# Altium schematic sheet SensePlates.SchDoc: Sense&Connectors
size Tabloid; Organization: Altium Limited; Address1: L3, 12a Rodborough Rd; Address2: Frenchs Forest; Address3: NSW; Address4: Australia 2086; DocumentNumber: LM-002; Revision: F; SheetNumber: 3; SheetTotal: 4
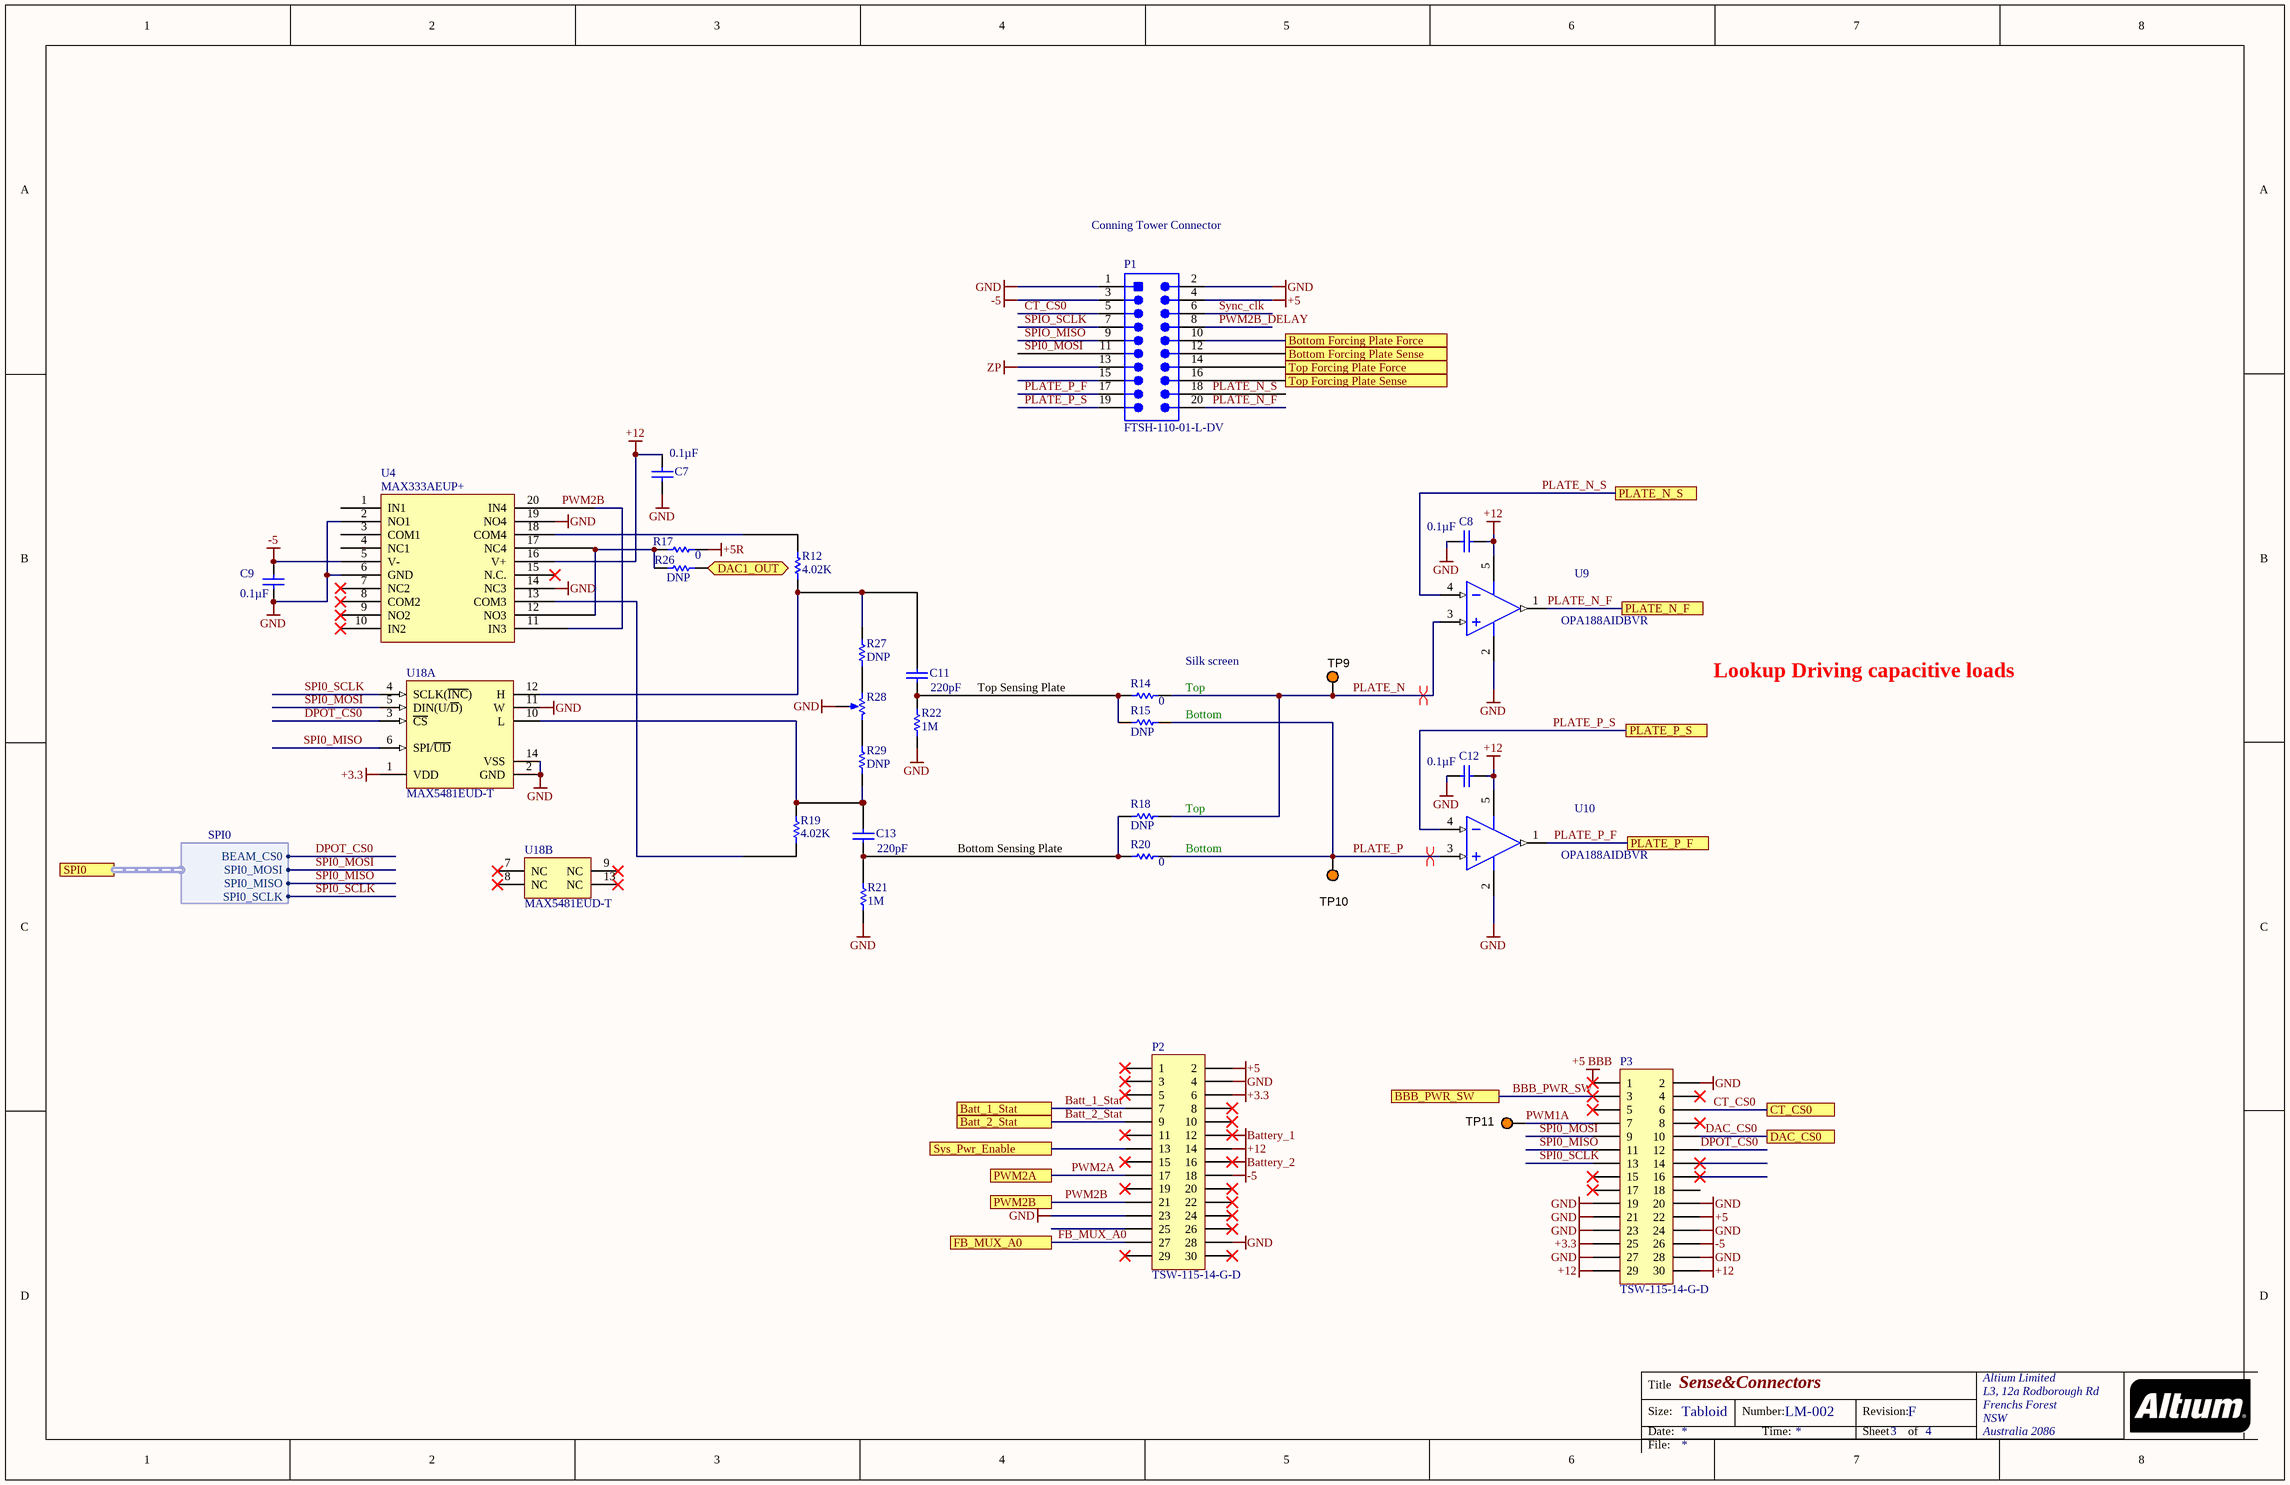
[diagram p0: SensePlates.SchDoc]

## Parts
C7  Capacitance: 0.1µF  [CAPC0805(2012)145_N]  (hidden comment: CAP CER 0.1UF 25V X7R 0805)
C8  Capacitance: 0.1µF  [CAPC0805(2012)145_N]  (hidden comment: CAP CER 0.1UF 25V X7R 0805)
C9  Capacitance: 0.1µF  [CAPC0805(2012)145_N]  (hidden comment: CAP CER 0.1UF 25V X7R 0805)
C11  Capacitance: 220pF  [CAPC0805(2012)155_L]  (hidden comment: CAP CER 1UF 25V X7R 0805)
C12  Capacitance: 0.1µF  [CAPC0805(2012)145_N]  (hidden comment: CAP CER 0.1UF 25V X7R 0805)
C13  Capacitance: 220pF  [CAPC0805(2012)155_L]  (hidden comment: CAP CER 1UF 25V X7R 0805)
P1  FTSH-110-01-L-DV  [SMTC-FTSH-110-01-L-DV_V]
P2  TSW-115-14-G-D  [TSW-115-14-G-D]
P3  TSW-115-14-G-D  [TSW-115-14-G-D]
R12  4.02K  [RESC0805(2012)_L]
R14  0  [RESC0805(2012)_L]
R15  DNP  [RESC0805(2012)_L]
R17  0  [RESC0805(2012)_L]
R18  DNP  [RESC0805(2012)_L]
R19  4.02K  [RESC0805(2012)_L]
R20  0  [RESC0805(2012)_L]
R21  1M  [RESC0805(2012)_L]
R22  1M  [RESC0805(2012)_L]
R26  DNP  [RESC0805(2012)_L]
R27  DNP  [RESC0402(1005)_M]
R28  DNP  [Trimmer 2.54]  (value not drawn)
R29  DNP  [RESC0402(1005)_M]
TP9  5003  [KSTN-5003]  (value not drawn)
TP10  5003  [KSTN-5003]  (value not drawn)
TP11  5003  [KSTN-5003]  (value not drawn)
U4  MAX333AEUP+  [TSOP65P640X90-20N]
U9  OPA188AIDBVR  [DBV0005A_M]
U10  OPA188AIDBVR  [DBV0005A_M]
U18  MAX5481EUD-T  [MAXM-U14-1_L]  (parts A,B of 2)

## Ports
Batt_1_Stat, Batt_2_Stat, BBB_PWR_SW, Bottom Forcing Plate Force, Bottom Forcing Plate Sense, CT_CS0, DAC1_OUT, DAC_CS0, FB_MUX_A0, PLATE_N_F, PLATE_N_S, PLATE_P_F, PLATE_P_S, PWM2A, PWM2B, SPI0 (harness SPI0), Sys_Pwr_Enable, Top Forcing Plate Force, Top Forcing Plate Sense

## Harnesses
SPI0: BEAM_CS0, SPI0_MOSI, SPI0_MISO, SPI0_SCLK

## Nets
+3.3: P2.6 P3.25 U18.1(VDD)
+5: P1.4 P2.2 P3.22
+5 BBB: P3.1
+5R: R17.1
+12: C7.1 C8.2 C12.2 P2.14 P3.29 P3.30 U4.16(V+) U9.5(V+) U10.5(V+)
-5: C9.1 P1.3 P2.18 P3.26 U4.5(V-)
Battery_1: P2.12
Battery_2: P2.16
GND: C7.2 C8.1 C9.2 C12.1 P1.1 P1.2 P2.4 P2.23 P2.28 P3.2 P3.19 P3.20 P3.21 P3.23 P3.24 P3.27 P3.28 R21.1 R22.1 R28.2(b) U4.2(NO1) U4.6(GND) U4.14(NC3) U4.19(NO4) U9.2(V-) U10.2(V-) U18.2(GND) U18.11(W) U18.14(VSS)
ZP: P1.13
Batt_1_Stat: P2.7 ; port Batt_1_Stat
Batt_2_Stat: P2.9 ; port Batt_2_Stat
BBB_PWR_SW: P3.3 ; port BBB_PWR_SW
Bottom Forcing Plate Force: P1.10 ; port Bottom Forcing Plate Force
Bottom Forcing Plate Sense: P1.12 ; port Bottom Forcing Plate Sense
CT_CS0: P1.5 P3.6 ; port CT_CS0
DAC1_OUT: R26.1 ; port DAC1_OUT
DAC_CS0: P3.10 ; port DAC_CS0
DPOT_CS0: P3.12 U18.3(~{CS}) ; port SPI0.BEAM_CS0
FB_MUX_A0: P2.27 ; port FB_MUX_A0
PLATE_N: R14.1 R18.1 TP9.1 U9.3(IN+)
PLATE_N_F: P1.20 U9.1(OUT) ; port PLATE_N_F
PLATE_N_S: P1.18 U9.4(IN-) ; port PLATE_N_S
PLATE_P: R15.1 R20.1 TP10.1 U10.3(IN+)
PLATE_P_F: P1.17 U10.1(OUT) ; port PLATE_P_F
PLATE_P_S: P1.19 U10.4(IN-) ; port PLATE_P_S
PWM1A: P3.7 TP11.1
PWM2A: P2.17 ; port PWM2A
PWM2B: P2.21 U4.11(IN3) U4.20(IN4) ; port PWM2B
PWM2B_DELAY: P1.8
SPI0_MISO: P3.11 U18.6(SPI/~{UD}) ; port SPI0.SPI0_MISO
SPI0_MOSI: P1.11 P3.9 U18.5(DIN(U/~{D})) ; port SPI0.SPI0_MOSI
SPI0_SCLK: P3.13 U18.4(SCLK(~{INC})) ; port SPI0.SPI0_SCLK
SPIO_MISO: P1.9
SPIO_SCLK: P1.7
Sync_clk: P1.6
Sys_Pwr_Enable: P2.13 ; port Sys_Pwr_Enable
Top Forcing Plate Force: P1.14 ; port Top Forcing Plate Force
Top Forcing Plate Sense: P1.16 ; port Top Forcing Plate Sense
NetC11_1: C11.1 R14.2 R15.2 R22.2
NetC11_2: C11.2 R12.1 R27.2 U18.12(H)
NetC13_1: C13.1 R18.2 R20.2 R21.2
NetC13_2: C13.2 R19.2 R29.1 U18.10(L)
NetR12_2: R12.2 U4.18(COM4)
NetR17_2: R17.2 R26.2 U4.12(NO3) U4.17(NC4)
NetR19_1: R19.1 U4.13(COM3)
NetR27_1: R27.1 R28.1(a)
NetR28_3: R28.3(c) R29.2

Not connected (* = marked no-connect by the designer): P1 15; P2 1* 3* 5* 8* 10* 11* 15* 19* 20* 22* 24* 25 26* 29* 30*; P3 4* 5* 8* 14* 15* 16* 17* 18; U4 1(IN1) 3(COM1) 4(NC1) 7(NC2)* 8(COM2)* 9(NO2)* 10(IN2)* 15(N.C.)*; U18 7(NC)* 8(NC)* 9(NC)* 13(NC)*

## Layout directives
differential pair: PLATE_N, PLATE_P

## Notes on the sheet
- Conning Tower Connector
- Top Sensing Plate
- Silk screen
- Top
- Lookup Driving capacitive loads
- Bottom
- (near R18) Top
- Bottom Sensing Plate
- Title
- Size:
- Date:
- Tabloid
- Number:
- Time:
- Revision:
- Sheet
- of
- File:

## Library data of the parts
C7-C9 C12 = CMP-1036-04795-1: Manufacturer: Murata Electronics North America; Manufacturer Part Number: GRM21BR71E104KA01L; Tolerance: ±10%; Supplier 1: Digi-Key; Supplier Part Number 1: 490-1673-6-ND; RoHS: RoHS Compliant; Category: Capacitors; Stock 1: 891652; Pricing 1: 1=0.2, 10=0.145, 100=0.0683, 500=0.04788, 1000=0.03964 (USD); Packaging: Digi-Reel®; Part Status: Active; Voltage - Rated: 25V; Temperature Coefficient: X7R; Operating Temperature: -55°C ~ 125°C; Features: -; Ratings: -; Applications: General Purpose; Mounting Type: Surface Mount, MLCC; Package / Case: 0805 (2012 Metric); Size / Dimension: 0.079" L x 0.049" W (2.00mm x 1.25mm); Height - Seated (Max): -; Thickness (Max): 0.053" (1.35mm); Lead Spacing: -; Lead Style: -; ComponentLink1URL: http://www.murata.com/~/media/webrenewal/support/library/catalog/products/capacitor/mlcc/c02e.ashx; ComponentLink1Description: http://www.murata.com/~/media/webrenewal/support/library/catalog/products/capacitor/mlcc/c02e.ashx
C11 C13 = CMP-1036-04882-1: Manufacturer: Murata Electronics North America; Manufacturer Part Number: GRM21BR71E105KA99L; Tolerance: ±10%; Supplier 1: Digi-Key; Supplier Part Number 1: 490-6484-6-ND; RoHS: RoHS Compliant; Category: Capacitors; Stock 1: 295074; Pricing 1: 1=0.14, 10=0.099, 100=0.0468, 500=0.0328, 1000=0.02715 (USD); Packaging: Digi-Reel®; Part Status: Active; Voltage - Rated: 25V; Temperature Coefficient: X7R; Operating Temperature: -55°C ~ 125°C; Features: -; Ratings: -; Applications: General Purpose; Mounting Type: Surface Mount, MLCC; Package / Case: 0805 (2012 Metric); Size / Dimension: 0.079" L x 0.049" W (2.00mm x 1.25mm); Height - Seated (Max): -; Thickness (Max): 0.053" (1.35mm); Lead Spacing: -; Lead Style: -; ComponentLink1URL: http://www.murata.com/~/media/webrenewal/support/library/catalog/products/capacitor/mlcc/c02e.ashx; ComponentLink1Description: http://www.murata.com/~/media/webrenewal/support/library/catalog/products/capacitor/mlcc/c02e.ashx
P1 = CMP-2000-06294-2: Male Header, Pitch 1.27 mm, 2 x 10 Position, Height 6.1 mm, -55 to 125 degC, RoHS, Tube; Manufacturer: Samtec; Online Catalog: FTSHSeries; Number of Positions Loaded: All; Connector Type: Header,Unshrouded; Product Training Modules: Board-to-BoardConnectors; Featured Product: Board-To-BoardInterconnectSystems; Other Names: SAM1161-10; EDA / CAD Models: DownloadfromAcceleratedDesigns; Number of Positions: 20; Catalog Drawings: FTSHSeriesFTSHSeriesSMTSide; Package Reference: FTSH-110-01-L-DV; Family: RectangularConnectors-Headers,MalePins; Mounting Technology: SurfaceMount; Contact Type: MalePin; Manufacturer URL: http://www.samtec.com/; Package URL: http://suddendocs.samtec.com/prints/ftsh-1xx-xx-xxx-dv-xxx-xxx-mkt.pdf; Package Description: Male Header, Pitch 1.27 mm, 2 x 10 Position, Height 6.1 mm; Packaging: Bulk; Termination: Solder; Category: Connectors,Interconnects; Fastening Type: -; Datasheet Version: F-215 , 02/2016; Contact Finish Thickness: 10µin(0.25µm); Number of Rows: 2; Datasheet URL: http://suddendocs.samtec.com/catalog_english/ftsh_smt.pdf; Mounting Type: SurfaceMount; Series: FTSH; Features: -; Contact Finish: Gold; Standard Package: 1; Color: Black
P2 P3 = Header 15X2: Header, 15-Pin, Dual row; Manufacturer: Samtec Inc.; Pitch - Mating: 0.100" (2.54mm); Number of Positions: 30; Number of Positions Loaded: All; Style: Board to Board or Cable; Shrouding: Unshrouded; Contact Length - Mating: 0.320" (8.13mm); Contact Length - Post: 0.110" (2.79mm); Overall Contact Length: 0.530" (13.46mm); Material Flammability Rating: UL94 V-0; Supplier 1: Digi-Key; Supplier Part Number 1: SAM1052-15-ND; Manufacturer Part Number: TSW-115-14-G-D; RoHS: RoHS Compliant; Category: Connectors, Interconnects; Stock 1: 0; Pricing 1: 1=3.69, 10=3.3, 100=2.7176, 500=2.1482, 1000=1.84409, 5000=1.68233, 10000=1.61763 (USD); Packaging: Bulk; Part Status: Active; Connector Type: Header; Contact Type: Male Pin; Number of Rows: 2; Row Spacing - Mating: 0.100" (2.54mm); Mounting Type: Through Hole; Termination: Solder; Fastening Type: Push-Pull; Insulation Height: 0.100" (2.54mm); Contact Shape: Square; Contact Finish - Mating: Gold; Contact Finish Thickness - Mating: 10.0µin (0.25µm); Contact Finish - Post: Gold; Contact Material: Phosphor Bronze; Insulation Material: Polybutylene Terephthalate (PBT); Features: -; Operating Temperature: -55°C ~ 125°C; Ingress Protection: -; Insulation Color: Black; Current Rating: -; Voltage Rating: -; Mated Stacking Heights: -; Contact Finish Thickness - Post: 3.00µin (0.076µm); Applications: -; ComponentLink1URL: http://suddendocs.samtec.com/prints/tsw-xxx-xx-xxx-x-xx-xxx-mkt.pdf; ComponentLink1Description: http://suddendocs.samtec.com/prints/tsw-xxx-xx-xxx-x-xx-xxx-mkt.pdf
R12 R19 = CMP-1013-00215-1: RES SMD 4.02K OHM 1% 1/8W 0805; Manufacturer: Vishay Dale; Manufacturer Part Number: CRCW08054K02FKEAHP; Power (Watts): 0.5W, 1/2W; Temperature Coefficient: ±100ppm/°C; Supplier 1: Digi-Key; Supplier Part Number 1: 541-4.02KTCT-ND; RoHS: RoHS Compliant; Category: Resistors; Stock 1: 2935; Pricing 1: 1=0.28, 10=0.233, 100=0.0911, 1000=0.03812, 2500=0.03494 (USD); Packaging: Cut Tape (CT); Part Status: Active; Tolerance: ±1%; Composition: Thick Film; Features: Automotive AEC-Q200, Pulse Withstanding; Operating Temperature: -55°C ~ 155°C; Package / Case: 0805 (2012 Metric); Supplier Device Package: 0805; Size / Dimension: 0.079" L x 0.049" W (2.00mm x 1.25mm); Height - Seated (Max): 0.020" (0.50mm); Failure Rate: -; ComponentLink1URL: http://www.vishay.com/docs/20043/crcwhpe3.pdf; ComponentLink1Description: http://www.vishay.com/docs/20043/crcwhpe3.pdf
R14 R15 R17 R18 R20 R26 = CMP-1013-00215-1: RES SMD 0 OHM JUMPER 1/8W 0805; Manufacturer: Panasonic Electronic Components; Manufacturer Part Number: ERJ-6GEY0R00V; Power (Watts): 0.125W, 1/8W; Supplier 1: Digi-Key; Supplier Part Number 1: P0.0ACT-ND; RoHS: RoHS Compliant; Category: Resistors; Stock 1: 3414819; Pricing 1: 1=0.1, 10=0.074, 25=0.0532, 50=0.0406, 100=0.03, 250=0.02288, 500=0.0183, 1000=0.01347 (USD); Packaging: Cut Tape (CT); Part Status: Active; Tolerance: Jumper; Composition: Thick Film; Features: Automotive AEC-Q200; Temperature Coefficient: -; Operating Temperature: -55°C ~ 155°C; Package / Case: 0805 (2012 Metric); Supplier Device Package: 0805; Size / Dimension: 0.079" L x 0.049" W (2.00mm x 1.25mm); Height - Seated (Max): 0.028" (0.70mm); Failure Rate: -; ComponentLink1URL: http://industrial.panasonic.com/www-cgi/jvcr13pz.cgi?E+PZ+3+AOA0001+ERJ6GEY0R00V+7+WW; ComponentLink1Description: http://industrial.panasonic.com/www-cgi/jvcr13pz.cgi?E+PZ+3+AOA0001+ERJ6GEY0R00V+7+WW
R21 R22 = CMP-1013-00215-1: RES SMD 1M OHM 1% 1/8W 0805; Manufacturer: Vishay Dale; Manufacturer Part Number: RCV08051M00FKEA; Power (Watts): 0.125W, 1/8W; Temperature Coefficient: ±100ppm/°C; Supplier 1: Digi-Key; Supplier Part Number 1: BC2810CT-ND; RoHS: RoHS Compliant; Category: Resistors; Stock 1: 15942; Pricing 1: 1=0.31, 10=0.266, 100=0.1041, 1000=0.04356, 2500=0.03993 (USD); Packaging: Cut Tape (CT); Part Status: Active; Tolerance: ±1%; Composition: Thick Film; Features: High Voltage; Operating Temperature: -55°C ~ 155°C; Package / Case: 0805 (2012 Metric); Supplier Device Package: 0805; Size / Dimension: 0.079" L x 0.049" W (2.00mm x 1.25mm); Height - Seated (Max): 0.020" (0.50mm); Failure Rate: -; ComponentLink1URL: http://www.vishay.com/docs/20054/rcve3.pdf; ComponentLink1Description: http://www.vishay.com/docs/20054/rcve3.pdf
R27 R29 = CMP-1011-00463-1: 7.5K
R28 = Trimmer: TRIMMER 5K OHM 0.25W PC PIN; Manufacturer: Vishay Foil Resistors (Division of Vishay Precision Group); Manufacturer Part Number: Y00535K00000J0L; Power (Watts): 0.25W, 1/4W; Tolerance: ±5%; Temperature Coefficient: ±10ppm/°C; Number of Turns: 21; Adjustment Type: Side Adjustment; Resistive Material: Metal Foil; Supplier 1: Digi-Key; Supplier Part Number 1: 804-1020-ND; RoHS: RoHS Compliant; Category: Potentiometers, Variable Resistors; Stock 1: 679; Pricing 1: 1=34.42, 10=32.265, 25=26.5292, 50=22.944, 100=22.227, 250=20.793, 500=19.2156 (USD); Packaging: Bulk; Part Status: Active; Resistance (Ohms): 5k; Mounting Type: Through Hole; Termination Style: PC Pins; Size / Dimension: Rectangular - 0.250" x 0.175" Face x 0.250" L (6.35mm x 4.45mm x 6.35mm); ComponentLink1URL: http://www.vishaypg.com/docs/63053/1240.pdf; ComponentLink1Description: http://www.vishaypg.com/docs/63053/1240.pdf
TP9-TP11 = CMP-1672-00009-1: Test Point, Orange, 1-Pin THD, RoHS; Peak Reverse Current: 600 uA; Forward Current: 3 A; Max Surge Current: 80 A; Forward Voltage: 1.08 V; Max Operating Temperature: 150 degC; PackageReference: 5003; Pins: 2; ComponentLink2URL: http://keyelco.com/userAssets/file/M65p56.pdf; PackageDescription: 1-Pin Through Hole Device, Dia 2.54 mm; Weight: 0.01 lb; Diameter: 5.3 mm; Mount: Through Hole; Package Quantity: 500; Packaging: Bulk; Min Operating Temperature: -65 degC; ComponentLink1Description: Manufacturer URL; Height: 0.25 inch; ComponentLink1URL: http://www.keyelco.com/; ComponentLink2Description: Datasheet; Width: 0.25 inch; REACH SVHC: No SVHC; RoHSCompliant: true; Radiation Hardening: No; Length: 9.5 mm; DatasheetVersion: Jun-15
U4 = MAX333CWP+: IC SWITCH QUAD SPDT 20TSSOP; Manufacturer: Maxim Integrated; Multiplexer/Demultiplexer Circuit: 2:1; On-State Resistance (Max): 45 Ohm; Channel-to-Channel Matching (&Delta;Ron): 2 Ohm (Max); Voltage - Supply, Single (V+): 10 V ~ 30 V; Voltage - Supply, Dual (V±): ±4.5 V ~ 20 V; Switch Time (Ton, Toff) (Max): 175ns, 145ns; Charge Injection: 2pC; Channel Capacitance (CS(off), CD(off)): 5pF; Current - Leakage (IS(off)) (Max): 250pA; Crosstalk: -78dB @ 1MHz; Supplier 1: Digi-Key; Supplier Part Number 1: MAX333AEUP+-ND; Manufacturer Part Number: MAX333AEUP+; RoHS: RoHS Compliant; Category: Integrated Circuits (ICs); Stock 1: 1328; Pricing 1: 1=6.77, 10=6.432, 25=6, 50=5.8942 (USD); Packaging: Tube; Part Status: Active; Switch Circuit: SPDT; -3db Bandwidth: -; Operating Temperature: -40°C ~ 85°C (TA); Package / Case: 20-TSSOP (0.173", 4.40mm Width); Supplier Device Package: 20-TSSOP; Base Part Number: MAX333; ComponentLink1URL: https://pdfserv.maximintegrated.com/en/ds/MAX333A.pdf; ComponentLink1Description: https://pdfserv.maximintegrated.com/en/ds/MAX333A.pdf
U9 U10 = CMP-0809-00005-2: Precision, Low Noise, Rail-to-Rail Output, Zero-Drift Operational Amplifier, 4 to 36 V, -40 to 125 degC, 5-pin SOT23 (DBV5), Green (RoHS & no Sb/Br); Manufacturer: Texas Instruments; Total Supply Voltage(Min)(+5V is 5, +/-5V is 10): 4; Offset Drift(Typ)(uV/C): 0.03; Rating: Catalog; SubFamily: Zero Drift Precision Amplifier; GBW(Typ)(MHz): 2; Slew Rate(Typ)(V/us): 0.8; Number of Channels: 1; CMRR(Min)(dB): 120; Iq per channel(Max)(mA): 0.51; Total Supply Voltage(Max)(+5V is 5, +/-5V is 10): 36; PartNumber: OPA188AIDBVR; ComponentLink2Description: Datasheet; ComponentLink2URL: http://www.ti.com/lit/ds/symlink/opa188.pdf; ComponentLink1Description: Manufacturer URL; Mounting Technology: Surface Mount; Eco-Plan: Green (RoHS & no Sb/Br); ComponentLink1URL: http://www.ti.com/; PackageVersion: 4073253-4/K, 03/2006; DatasheetVersion: SBOS642A; ComponentLink3Description: Package Specification; PackageReference: DBV0005A; ComponentLink3URL: http://www.ti.com/litv/pdf/mpds018i; PackageDescription: 5-Pin Plastic Small Outline, Body 1.6 x 2.9 mm, Pitch 0.95 mm; Code_JEDEC: MO-178
U18 = CMP-0023-00489-1: 10k Digital Potentiometer (Voltage Divider) with 3-Wire Serial SPI Control Interface, Non-Volatile, Linear Taper, 1024 Steps, -40 to 85 degC, 14-pin TSSOP (U14-1), Tape and Reel; PackageVersion: Rev. L, 07/2010; PackageReference: U14-1; DatasheetVersion: Rev. 5; ComponentLink1Description: Manufacturer URL; Mounting Technology: Surface Mount; Code_JEDEC: MO-153; Features: EEPROM Wiper Memory; ComponentLink2URL: http://datasheets.maximintegrated.com/en/ds/MAX5481-MAX5484.pdf; PartNumber: MAX5481EUD-T; ComponentLink1URL: http://www.maximintegrated.com/; Control Interface: 3-Wire Serial SPI; ComponentLink2Description: Datasheet; ComponentLink3URL: http://pdfserv.maximintegrated.com/package_dwgs/21-0066.PDF; Applications: Fiber Communications, Power Supply Cal.; ComponentLink3Description: Package Specification; PackageDescription: 14-Pin Thin Shrink Small-Outline Package (U14-1), Body 5 x 4.4 mm, Pitch 0.65 mm; PartId: 1